# Altium schematic sheet In-Out.SchDoc
size A4
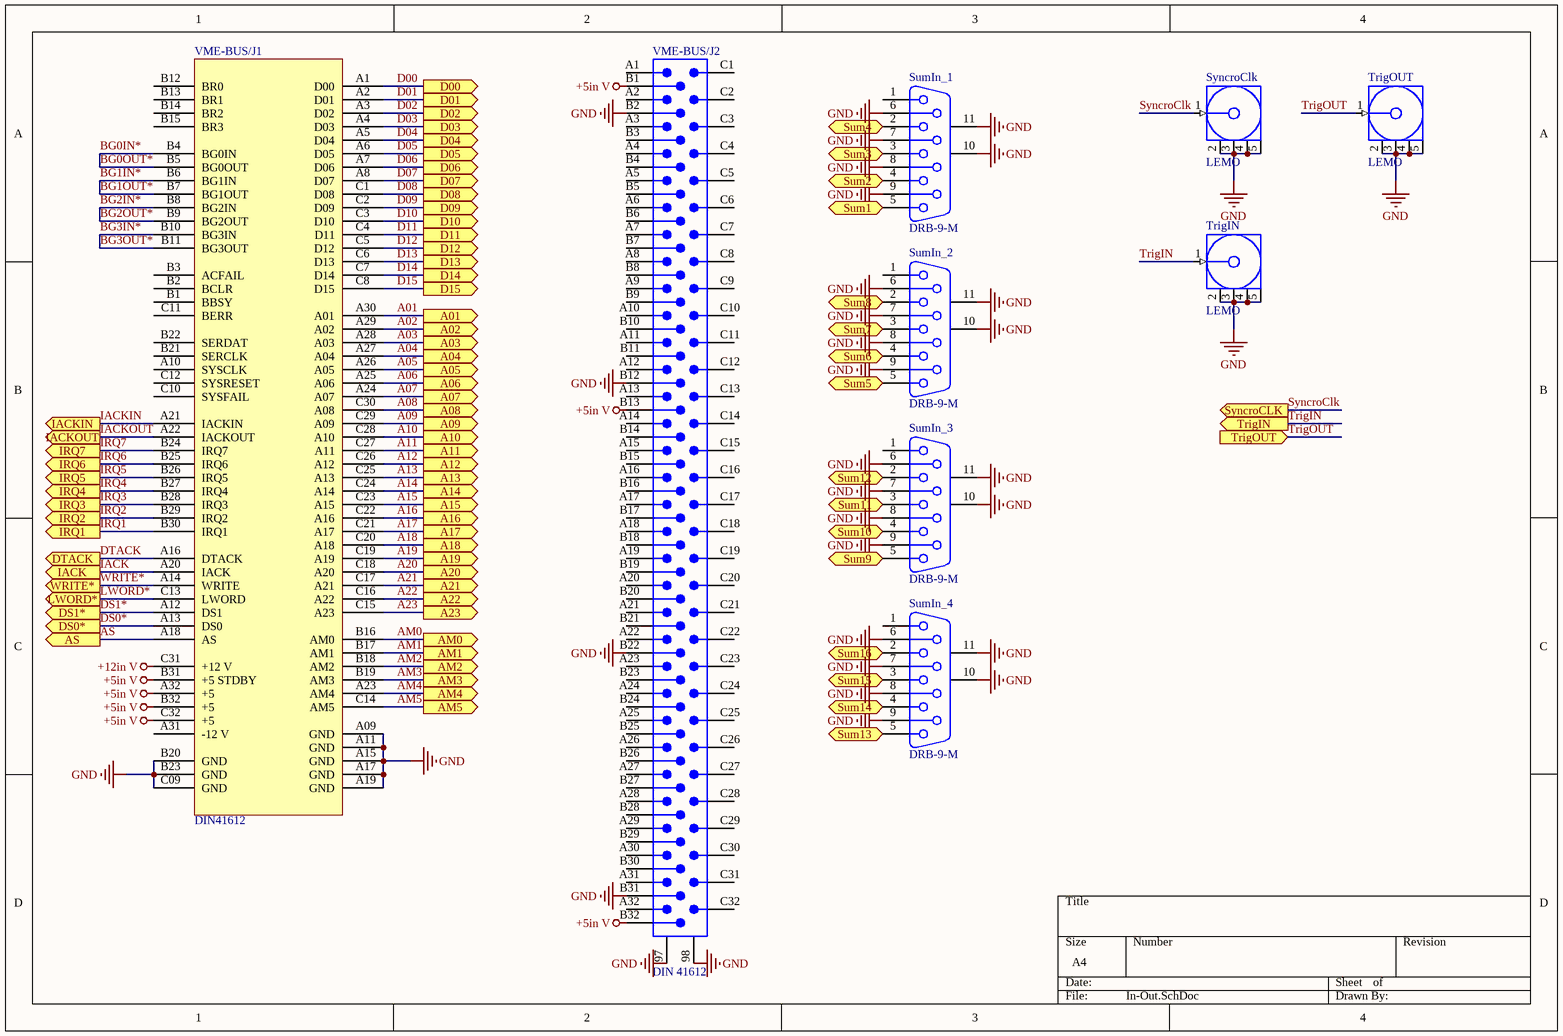
[diagram p0: In-Out.SchDoc]

## Parts
SumIn_1  DRB-9-M  [DSUB1.385-2H9]
SumIn_2  DRB-9-M  [DSUB1.385-2H9]
SumIn_3  DRB-9-M  [DSUB1.385-2H9]
SumIn_4  DRB-9-M  [DSUB1.385-2H9]
SyncroClk  LEMO  [LEMO]
TrigIN  LEMO  [LEMO]
TrigOUT  LEMO  [LEMO]
VME-BUS/J1  DIN41612  [EURO2.54-2H96]
VME-BUS/J2  DIN 41612  [EURO2.54-2H96]

## Ports
A01 (out), A02 (out), A03 (out), A04 (out), A05 (out), A06 (out), A07 (out), A08 (out), A09 (out), A10 (out), A11 (out), A12 (out), A13 (out), A14 (out), A15 (out), A16 (out), A17 (out), A18 (out), A19 (out), A20 (out), A21 (out), A22 (out), A23 (out), AM0 (out), AM1 (out), AM2 (out), AM3 (out), AM4 (out), AM5 (out), AS (out), D00 (out), D01 (out), D02 (out), D03 (out), D04 (out), D05 (out), D06 (out), D07 (out), D08 (out), D09 (out), D10 (out), D11 (out), D12 (out), D13 (out), D14 (out), D15 (out), DS0* (out), DS1* (out), DTACK (out), IACK (out), IACKIN (out), IACKOUT (out), IRQ1 (out), IRQ2 (out), IRQ3 (out), IRQ4 (out), IRQ5 (out), IRQ6 (out), IRQ7 (out), LWORD* (out), Sum1 (out), Sum2 (out), Sum3 (out), Sum4 (out), Sum5 (out), Sum6 (out), Sum7 (out), Sum8 (out), Sum9 (out), Sum10 (out), Sum11 (out), Sum12 (out), Sum13 (out), Sum14 (out), Sum15 (out), Sum16 (out), SyncroCLK (out), TrigIN (out), TrigOUT (in), WRITE* (out)

## Nets
+5in V: VME-BUS/J1.A32(+5) VME-BUS/J1.B31(+5_STDBY) VME-BUS/J1.B32(+5) VME-BUS/J1.C32(+5) VME-BUS/J2.B1 VME-BUS/J2.B13 VME-BUS/J2.B32
+12in V: VME-BUS/J1.C31(+12_V)
GND: SumIn_1.6 SumIn_1.7 SumIn_1.8 SumIn_1.9 SumIn_1.10(MH1) SumIn_1.11(MH2) SumIn_2.6 SumIn_2.7 SumIn_2.8 SumIn_2.9 SumIn_2.10(MH1) SumIn_2.11(MH2) SumIn_3.6 SumIn_3.7 SumIn_3.8 SumIn_3.9 SumIn_3.10(MH1) SumIn_3.11(MH2) SumIn_4.6 SumIn_4.7 SumIn_4.8 SumIn_4.9 SumIn_4.10(MH1) SumIn_4.11(MH2) SyncroClk.2(GND) SyncroClk.3(GND) SyncroClk.4(GND) SyncroClk.5(GND) TrigIN.2(GND) TrigIN.3(GND) TrigIN.4(GND) TrigIN.5(GND) TrigOUT.2(GND) TrigOUT.3(GND) TrigOUT.4(GND) TrigOUT.5(GND) VME-BUS/J1.A09(GND) VME-BUS/J1.A11(GND) VME-BUS/J1.A15(GND) VME-BUS/J1.A17(GND) VME-BUS/J1.A19(GND) VME-BUS/J1.B20(GND) VME-BUS/J1.B23(GND) VME-BUS/J1.C09(GND) VME-BUS/J2.97 VME-BUS/J2.98 VME-BUS/J2.B2 VME-BUS/J2.B12 VME-BUS/J2.B22 VME-BUS/J2.B31
A01: VME-BUS/J1.A30(A01) ; port A01
A02: VME-BUS/J1.A29(A02) ; port A02
A03: VME-BUS/J1.A28(A03) ; port A03
A04: VME-BUS/J1.A27(A04) ; port A04
A05: VME-BUS/J1.A26(A05) ; port A05
A06: VME-BUS/J1.A25(A06) ; port A06
A07: VME-BUS/J1.A24(A07) ; port A07
A08: VME-BUS/J1.C30(A08) ; port A08
A09: VME-BUS/J1.C29(A09) ; port A09
A10: VME-BUS/J1.C28(A10) ; port A10
A11: VME-BUS/J1.C27(A11) ; port A11
A12: VME-BUS/J1.C26(A12) ; port A12
A13: VME-BUS/J1.C25(A13) ; port A13
A14: VME-BUS/J1.C24(A14) ; port A14
A15: VME-BUS/J1.C23(A15) ; port A15
A16: VME-BUS/J1.C22(A16) ; port A16
A17: VME-BUS/J1.C21(A17) ; port A17
A18: VME-BUS/J1.C20(A18) ; port A18
A19: VME-BUS/J1.C19(A19) ; port A19
A20: VME-BUS/J1.C18(A20) ; port A20
A21: VME-BUS/J1.C17(A21) ; port A21
A22: VME-BUS/J1.C16(A22) ; port A22
A23: VME-BUS/J1.C15(A23) ; port A23
AM0: VME-BUS/J1.B16(AM0) ; port AM0
AM1: VME-BUS/J1.B17(AM1) ; port AM1
AM2: VME-BUS/J1.B18(AM2) ; port AM2
AM3: VME-BUS/J1.B19(AM3) ; port AM3
AM4: VME-BUS/J1.A23(AM4) ; port AM4
AM5: VME-BUS/J1.C14(AM5) ; port AM5
AS: VME-BUS/J1.A18(AS) ; port AS
BG0IN*: VME-BUS/J1.B4(BG0IN) VME-BUS/J1.B5(BG0OUT)  [also labelled BG0OUT*]
BG1IN*: VME-BUS/J1.B6(BG1IN) VME-BUS/J1.B7(BG1OUT)  [also labelled BG1OUT*]
BG2IN*: VME-BUS/J1.B8(BG2IN) VME-BUS/J1.B9(BG2OUT)  [also labelled BG2OUT*]
BG3IN*: VME-BUS/J1.B10(BG3IN) VME-BUS/J1.B11(BG3OUT)  [also labelled BG3OUT*]
D00: VME-BUS/J1.A1(D00) ; port D00
D01: VME-BUS/J1.A2(D01) ; port D01
D02: VME-BUS/J1.A3(D02) ; port D02
D03: VME-BUS/J1.A4(D03) ; port D03
D04: VME-BUS/J1.A5(D04) ; port D04
D05: VME-BUS/J1.A6(D05) ; port D05
D06: VME-BUS/J1.A7(D06) ; port D06
D07: VME-BUS/J1.A8(D07) ; port D07
D08: VME-BUS/J1.C1(D08) ; port D08
D09: VME-BUS/J1.C2(D09) ; port D09
D10: VME-BUS/J1.C3(D10) ; port D10
D11: VME-BUS/J1.C4(D11) ; port D11
D12: VME-BUS/J1.C5(D12) ; port D12
D13: VME-BUS/J1.C6(D13) ; port D13
D14: VME-BUS/J1.C7(D14) ; port D14
D15: VME-BUS/J1.C8(D15) ; port D15
DS0*: VME-BUS/J1.A13(DS0) ; port DS0*
DS1*: VME-BUS/J1.A12(DS1) ; port DS1*
DTACK: VME-BUS/J1.A16(DTACK) ; port DTACK
IACK: VME-BUS/J1.A20(IACK) ; port IACK
IACKIN: VME-BUS/J1.A21(IACKIN) ; port IACKIN
IACKOUT: VME-BUS/J1.A22(IACKOUT) ; port IACKOUT
IRQ1: VME-BUS/J1.B30(IRQ1) ; port IRQ1
IRQ2: VME-BUS/J1.B29(IRQ2) ; port IRQ2
IRQ3: VME-BUS/J1.B28(IRQ3) ; port IRQ3
IRQ4: VME-BUS/J1.B27(IRQ4) ; port IRQ4
IRQ5: VME-BUS/J1.B26(IRQ5) ; port IRQ5
IRQ6: VME-BUS/J1.B25(IRQ6) ; port IRQ6
IRQ7: VME-BUS/J1.B24(IRQ7) ; port IRQ7
LWORD*: VME-BUS/J1.C13(LWORD) ; port LWORD*
Sum1: SumIn_1.5 ; port Sum1
Sum2: SumIn_1.4 ; port Sum2
Sum3: SumIn_1.3 ; port Sum3
Sum4: SumIn_1.2 ; port Sum4
Sum5: SumIn_2.5 ; port Sum5
Sum6: SumIn_2.4 ; port Sum6
Sum7: SumIn_2.3 ; port Sum7
Sum8: SumIn_2.2 ; port Sum8
Sum9: SumIn_3.5 ; port Sum9
Sum10: SumIn_3.4 ; port Sum10
Sum11: SumIn_3.3 ; port Sum11
Sum12: SumIn_3.2 ; port Sum12
Sum13: SumIn_4.5 ; port Sum13
Sum14: SumIn_4.4 ; port Sum14
Sum15: SumIn_4.3 ; port Sum15
Sum16: SumIn_4.2 ; port Sum16
SyncroClk: SyncroClk.1(Signal) ; port SyncroCLK
TrigIN: TrigIN.1(Signal) ; port TrigIN
TrigOUT: TrigOUT.1(Signal) ; port TrigOUT
WRITE*: VME-BUS/J1.A14(WRITE) ; port WRITE*

Not connected (* = marked no-connect by the designer): SumIn_1 1; SumIn_2 1; SumIn_3 1; SumIn_4 1; VME-BUS/J1 A10(SYSCLK) A31(-12_V) B1(BBSY) B2(BCLR) B3(ACFAIL) B12(BR0) B13(BR1) B14(BR2) B15(BR3) B21(SERCLK) B22(SERDAT) C10(SYSFAIL) C11(BERR) C12(SYSRESET); VME-BUS/J2 A1 A2 A3 A4 A5 A6 A7 A8 A9 A10 A11 A12 A13 A14 A15 A16 A17 A18 A19 A20 A21 A22 A23 A24 A25 A26 A27 A28 A29 A30 A31 A32 B3 B4 B5 B6 B7 B8 B9 B10 B11 B14 B15 B16 B17 B18 B19 B20 B21 B23 B24 B25 B26 B27 B28 B29 B30 C1 C2 C3 C4 C5 C6 C7 C8 C9 C10 C11 C12 C13 C14 C15 C16 C17 C18 C19 C20 C21 C22 C23 C24 C25 C26 C27 C28 C29 C30 C31 C32

## Library data of the parts
SumIn_1-SumIn_4 = D Connector 9: Receptacle Assembly, 9 Position, Right Angle; PackageDocument: O; Positions: 9; Published: 15-Jun-2001; LatestRevisionDate: 17-Jul-2002; LatestRevisionNote: Re-released for DXP Platform.; DatasheetDocument: 1-Sep-1999; PackageReference: 788750; Publisher: Altium Limited; Orientation: Right Angle; Gender: Receptacle
SyncroClk TrigIN TrigOUT = COAX-F: RF Coaxial PCB Connector, MCX; Thru-Hole, Right-Angle Mount Socket, Blunt Post Terminal, 50 Ohm Impedance; PCB_Layout: Complies with manufacturer's recommendation.; DrillSize: Corresponds to nominal value.; Published: 15-Jul-2004; LatestRevisionDate: 15-Jul-2004; LatestRevisionNote: Component Replaced.; DatasheetDocument: 30-May-2003; PackageDocument: 04-Jul-1999; PackageReference: 919-119J-51AX; Publisher: Altium Limited; ComponentLink1Description: Manufacturer Link; ComponentLink1URL: http://www.amphenolrf.com/
VME-BUS/J1 = VME-P1/J1
VME-BUS/J2 = CNVME96: 96-Pin Connector (3x32 2.54mm grid); Text Field6: Alternate Layout Available; Text Field7: Published 14-Feb-2002